# Altium project E17-04-BMS.PrjPcb (part 2 of 2)
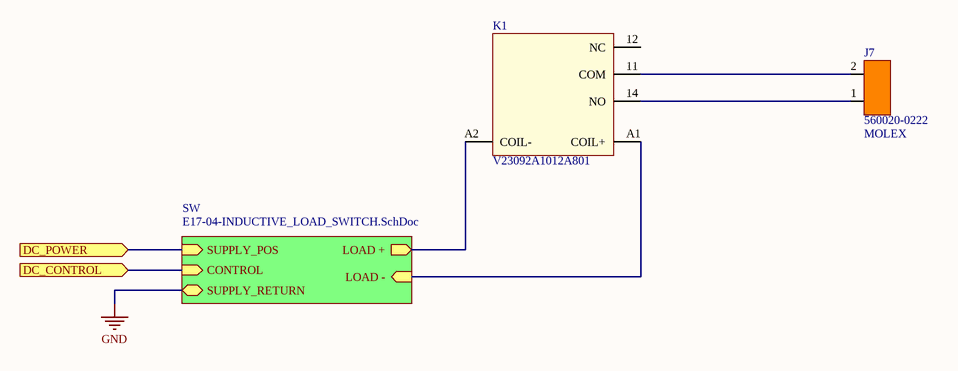
[diagram p20: E17-04_DC_DC_CONTROL.SchDoc]

## Nets that join several sheets
3.3V: CONN/IP (D28_CONN_IP.3), BSPD/IP (D17_IP1.3), E17-04_IMD (R60.1), IMD/IP (D17_IP4.3), IMD/IP (D17_IP3.3), E17-04-ISO_SPI (8 pins), E17-04-MCU (7 pins), E17-04-HV_MEASURE (C18.1 C21.1 R43.1 U4.19), E17-04-POWER (3.3V.1 C4.2 LED4.2 U2.3), HVD/IP (D17_IP2.3), IP (D17_IP5.3), IP (D17_IP6.3)
5V: E17-04-CONNECTORS (D20.3 J3.14 R21.1), E17-04_BSPD (11 pins), E17-04-POWER (5V.1 C2.2 LED2#2.2 U1.3), map 5v to 3v3 (O2.8)
12V: E17-04-CONNECTORS (J3.18 J3.21), E17-04_BSPD (6 pins), E17-04_IMD (D25.3 J4.2 K5.1 LED9.2), E17-04-POWER (6 pins), E17-04_Charger Control (K7.A2), CHRG/SW (D1_SW3.1 D2_SW3.3), E17-04-Energy_Meter (D24.1)
GND: E17-04-CONNECTORS (11 pins), CONN/IP (R66_CONN_IP.2), E17-04_BSPD (14 pins), BSPD/IP (R66_BSPD_IP.2), E17-04_IMD (8 pins), IMD/IP (R66_IMD_IP#1.2), IMD/IP (R66_IMD_IP#2.2), PCDC/SW (Q1_SW5.1 Q1_SW5.2 Q1_SW5.3 R2_SW5.1), E17-04-CONTACTOR_CONTROL (R2#1.1), AIR/SW (Q1_SW4.1 Q1_SW4.2 Q1_SW4.3 R2_SW4.1), AIR/SW (Q1_SW1.1 Q1_SW1.2 Q1_SW1.3 R2_SW1.1), E17-04-ISO_SPI (7 pins), E17-04-MCU (6 pins), E17-04-HV_MEASURE (C19.1 C20.1 U4.11), E17-04-POWER (10 pins), HVD/IP (R66_HVD_IP.2), IP (R66_IP#1.2), CHRG/SW (Q1_SW3.1 Q1_SW3.2 Q1_SW3.3 R2_SW3.1), ICS/SW (Q1_ICS_SW.1 Q1_ICS_SW.2 Q1_ICS_SW.3 R2_ICS_SW.1), IP (R66_IP#2.2), map 5v to 3v3 (O2.4 O2.5 R74.2), E17-04-Energy_Meter (J14.2), DCDC/SW (Q1_DCDC_SW.1 Q1_DCDC_SW.2 Q1_DCDC_SW.3 R2_DCDC_SW.1)
HV_COM: E17-04-PRECHARGE-DISCHARGE (J8.3), E17-04-TSVP (U3.1), E17-04-HV_MEASURE (13 pins), E17-04-HV-CONNECTORS (J1.1 J1.2 J10.1)
V_CAN: E17-04-CONNECTORS (J5.2), E17-04-POWER (V_CAN.1)
+: E17-04-PRECHARGE-DISCHARGE (K3.12), E17-04-TSVP (U3.5), E17-04-HV_MEASURE (R34.1), E17-04-HV-CONNECTORS (J2.1 J2.2 J9.4), E17-04_ICS (R26.2)
-: E17-04-HV-CONNECTORS (J9.6), E17-04_ICS (K2.11)
~{IMD FAUL}T 3V3: E17-04_IMD (IMD_F1.1 Q12.4), IMD/IP (D17_IP4.1 R35_IP4.2), E17-04-MCU (PB1.23)
~{IMD FAUL}T 12V: E17-04_IMD (J4.6 R14.1), IMD/IP (R35_IP4.1 R66_IMD_IP#1.1)
BRAKE_SENSE: E17-04-CONNECTORS (D19.3 D20.1 R22.2), E17-04_BSPD (K4.12), map 5v to 3v3 (O2.3)
BRAKE_SENSE_ANALOG: E17-04-MCU (PB1.22), map 5v to 3v3 (R74.1 R75.1)
BRB_SENSE: E17-04-MCU (PB1.32), IP (D17_IP5.1 R35_IP5.2)
BSPD_DEMO: E17-04-CONNECTORS (J3.6), E17-04_BSPD (D1.1 K4.A2 R7.1)
BSPD_SENSE: BSPD/IP (D17_IP1.1 R35_IP1.2), E17-04-MCU (PB1.28)
CAN_N: E17-04-CONNECTORS (J5.5 R76.1), E17-04-MCU (PB1.19)
CAN_P: E17-04-CONNECTORS (J5.4 R76.2), E17-04-MCU (PB1.17)
CHARGE CONT A: E17-04-CONNECTORS (J3.16), E17-04_Charger Control (K7.11)
CHARGE CONT B: E17-04-CONNECTORS (J3.17), E17-04_Charger Control (K7.14)
CONT_CHARGE: E17-04-MCU (PB1.18), CHRG/SW (CONTROL1_CHRG_SW.1 Q1_SW3.4 R2_SW3.2)
CONT_DC_DC: E17-04-MCU (PB1.33), DCDC/SW (CONTROL1_DCDC_SW.1 Q1_DCDC_SW.4 R2_DCDC_SW.2)
CONT_NEG: AIR/SW (CONTROL1_AIR_SW#1.1 Q1_SW4.4 R2_SW4.2), E17-04-MCU (PB1.25)
CONT_POS: AIR/SW (CONTROL1_AIR_SW#2.1 Q1_SW1.4 R2_SW1.2), E17-04-MCU (PB1.27)
CONT_PRE: PCDC/SW (CONTROL1_PCDC_SW.1 Q1_SW5.4 R2_SW5.2), E17-04-MCU (PB1.29)
CONTROL: E17-04-MCU (PB1.31), ICS/SW (CONTROL1_ICS_SW.1 Q1_ICS_SW.4 R2_ICS_SW.2)
DC_POWER: E17-04-CONNECTORS (J3.4), E17-04-PRECHARGE-DISCHARGE (K3.A2), PCDC/SW (D1_SW5.1 D2_SW5.3), E17-04-CONTACTOR_CONTROL (J12.1 J13.1 LED2#1.2), AIR/SW (D1_SW4.1 D2_SW4.3), AIR/SW (D1_SW1.1 D2_SW1.3), E17-04_ICS (K2.A2), ICS/SW (D1_ICS_SW.1 D2_ICS_SW.3), IP (R35_IP6.1 R66_IP#2.1), E17-04_DC_DC_CONTROL (K1.A2), DCDC/SW (D1_DCDC_SW.1 D2_DCDC_SW.3)
HV_HVD: E17-04-PRECHARGE-DISCHARGE (K3.14), E17-04-HV_MEASURE (R30.1), E17-04-HV-CONNECTORS (J9.1)
HV_SHUNT_NEG: E17-04-HV_MEASURE (R35.2), E17-04-HV-CONNECTORS (J10.3)
HV_SHUNT_POS: E17-04-HV_MEASURE (R36.2), E17-04-HV-CONNECTORS (J10.2)
HVD_SENSE: E17-04-MCU (PB1.30), HVD/IP (D17_IP2.1 R35_IP2.2)
IL_IN: E17-04-CONNECTORS (J3.3), E17-04_BSPD (K6.4), IP (R35_IP5.1 R66_IP#1.1)
IL_IN: E17-04_BSPD (K6.8), BSPD/IP (R35_IP1.1 R66_BSPD_IP.1), E17-04-HVD (J15.1)
IL_IN: E17-04_IMD (K5.4), E17-04-HVD (J15.2), HVD/IP (R35_IP2.1 R66_HVD_IP.1)
IL_OUT: E17-04-CONNECTORS (J3.5), E17-04_IMD (K5.8)
IMD LED GND: E17-04-CONNECTORS (J3.15), E17-04_IMD (Q9.3)
IMD_PWM+: E17-04_IMD (IMD_R1.1 J4.5 R19.1), IMD/IP (R35_IP3.1 R66_IMD_IP#2.1)
IMD_SENSE_GND1: E17-04-CONNECTORS (J3.22), E17-04_IMD (J4.3)
IMD_SENSE_GND2: E17-04-CONNECTORS (J3.23), E17-04_IMD (J4.4)
IMD_STATUS: IMD/IP (D17_IP3.1 R35_IP3.2), E17-04-MCU (PB1.16)
ISO_SPI.~{CS}: E17-04-ISO_SPI (U5.5), E17-04-MCU (PB1.40)
ISO_SPI.MISO: E17-04-ISO_SPI (R44.2 U5.3), E17-04-MCU (PB1.44)
ISO_SPI.MOSI: E17-04-ISO_SPI (U5.2), E17-04-MCU (PB1.46)
ISO_SPI.SCLK: E17-04-ISO_SPI (U5.4), E17-04-MCU (PB1.42)
LOAD -: E17-04-PRECHARGE-DISCHARGE (K3.A1), PCDC/SW (6 pins)
LOAD -: E17-04-CONTACTOR_CONTROL (J13.2), AIR/SW (6 pins)
LOAD -: E17-04-CONTACTOR_CONTROL (J12.2), AIR/SW (6 pins)
LOAD -: E17-04_Charger Control (K7.A1), CHRG/SW (6 pins)
LOAD -: E17-04_ICS (K2.A1), ICS/SW (6 pins)
LOAD -: E17-04_DC_DC_CONTROL (K1.A1), DCDC/SW (6 pins)
NetPB1_58: E17-04-CONNECTORS (R20.2), E17-04-MCU (PB1.58)
out: CONN/IP (D28_CONN_IP.1 R67_CONN_IP.2), E17-04-MCU (PB1.60)
TSAL: E17-04-CONNECTORS (J3.7), E17-04-TSVP (F1.3 F1.4 J18.2 LED13.2)
TSAL GND: E17-04-CONNECTORS (J3.8), E17-04-TSVP (J18.1 R13.1 U3.10)
TSMS_SENSE: E17-04-MCU (PB1.26), IP (D17_IP6.1 R35_IP6.2)
Vin: E17-04-CONNECTORS (J3.1), CONN/IP (R66_CONN_IP.1 R67_CONN_IP.1)